# Altium schematic sheet MainBoard.SchDoc
size A4; SheetNumber: 1; SheetTotal: 6
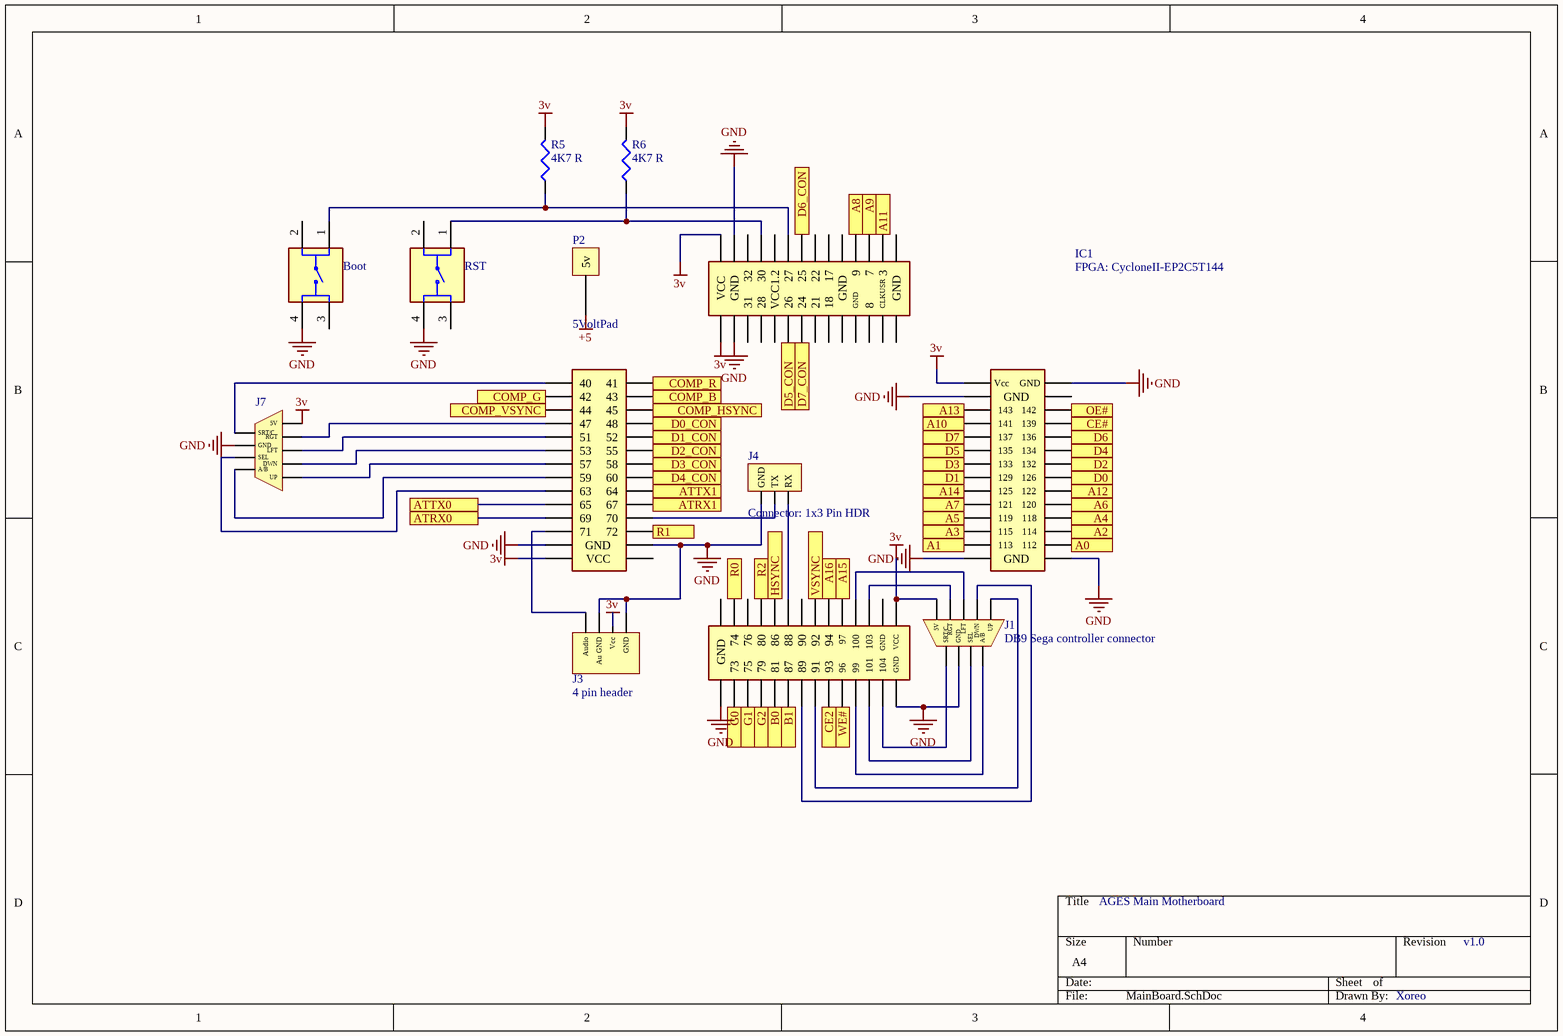
[diagram p0: MainBoard.SchDoc]

## Parts
Boot  Button  [Button]  (value not drawn)
IC1  FPGA: CycloneII-EP2C5T144  [Cyclone II]
J1  DB9 Sega controller connector  [DB9 Connector]
J3  4 pin header  [4 HDR]
J4  Connector: 1x3 Pin HDR  [3 HDR]
J7  DB9 Sega controller connector  [DB9 Connector]  (value not drawn)
P2  5VoltPad  [5VoltPad]
R5  4K7 R  [Resistor 0603]
R6  4K7 R  [Resistor 0603]
RST  Button  [Button]  (value not drawn)

## Ports
A0, A1, A2, A3, A4, A5, A6, A7, A8, A9, A10, A11, A12, A13, A14, A15, A16, ATRX0, ATRX1, ATTX0, ATTX1, B0, B1, CE2, CE#, COMP_B, COMP_G, COMP_HSYNC, COMP_R, COMP_VSYNC, D0, D0_CON, D1, D1_CON, D2, D2_CON, D3, D3_CON, D4, D4_CON, D5, D5_CON, D6, D6_CON, D7, D7_CON, G0, G1, G2, HSYNC, OE#, R0, R1, R2, VSYNC, WE#

## Nets
3v: IC1.27(VCC) IC1.28(VCC) IC1.55 IC1.57(VCC) IC1.86(Vcc) J1.5(5V) J3.2(Vcc) J7.5(5V) R5.2 R6.2
+5: P2.1(5v)
GND: Boot.4 IC1.25(GND) IC1.26(GND) IC1.53 IC1.54(GND) IC1.58(GND) IC1.84(GND) IC1.85(GND) IC1.88 IC1.111(GND) IC1.112 J1.8(GND) J3.1(GND) J3.3(Au_GND) J4.1(GND) J7.8(GND) RST.4
A0: IC1.109(112) ; port A0
A1: IC1.110(113) ; port A1
A2: IC1.107(114) ; port A2
A3: IC1.108(115) ; port A3
A4: IC1.105(118) ; port A4
A5: IC1.106(119) ; port A5
A6: IC1.103(120) ; port A6
A7: IC1.104(121) ; port A7
A8: IC1.7(9) ; port A8
A9: IC1.5(7) ; port A9
A10: IC1.92(141) ; port A10
A11: IC1.3 ; port A11
A12: IC1.101(122) ; port A12
A13: IC1.90(143) ; port A13
A14: IC1.102(125) ; port A14
A15: IC1.65(97) ; port A15
A16: IC1.67(94) ; port A16
ATRX0: IC1.49(69) ; port ATRX0
ATRX1: IC1.48(67) ; port ATRX1
ATTX0: IC1.47(65) ; port ATTX0
ATTX1: IC1.46(64) ; port ATTX1
B0: IC1.76(81) ; port B0
B1: IC1.74(87) ; port B1
CE2: IC1.68(93) ; port CE2
CE#: IC1.91(139) ; port CE#
COMP_B: IC1.32(43) ; port COMP_B
COMP_G: IC1.31(42) ; port COMP_G
COMP_HSYNC: IC1.34(45) ; port COMP_HSYNC
COMP_R: IC1.30(41) ; port COMP_R
COMP_VSYNC: IC1.33(44) ; port COMP_VSYNC
D0: IC1.99(126) ; port D0
D0_CON: IC1.36(48) ; port D0_CON
D1: IC1.100(129) ; port D1
D1_CON: IC1.38(52) ; port D1_CON
D2: IC1.97(132) ; port D2
D2_CON: IC1.40(55) ; port D2_CON
D3: IC1.98(133) ; port D3
D3_CON: IC1.42(58) ; port D3_CON
D4: IC1.95(134) ; port D4
D4_CON: IC1.44(60) ; port D4_CON
D5: IC1.96(135) ; port D5
D5_CON: IC1.18(26) ; port D5_CON
D6: IC1.93(136) ; port D6
D6_CON: IC1.15(25) ; port D6_CON
D7: IC1.94(137) ; port D7
D7_CON: IC1.16(24) ; port D7_CON
G0: IC1.82(73) ; port G0
G1: IC1.80(75) ; port G1
G2: IC1.78(79) ; port G2
HSYNC: IC1.75(86) ; port HSYNC
OE#: IC1.89(142) ; port OE#
R0: IC1.81(74) ; port R0
R1: IC1.52(72) ; port R1
R2: IC1.77(80) ; port R2
VSYNC: IC1.69(92) ; port VSYNC
WE#: IC1.66(96) ; port WE#
NetBoot_1: Boot.1 IC1.17(27) R5.1
NetIC1_21: IC1.21(30) R6.1 RST.1
NetIC1_29: IC1.29(40) J7.9(SRT/C)
NetIC1_35: IC1.35(47) J7.4(RGT)
NetIC1_37: IC1.37(51) J7.3(LFT)
NetIC1_39: IC1.39(53) J7.2(DWN)
NetIC1_41: IC1.41(57) J7.1(UP)
NetIC1_43: IC1.43(59) J7.6(A/B)
NetIC1_45: IC1.45(63) J7.7(SEL)
NetIC1_50: IC1.50(70) J4.2(TX)
NetIC1_51: IC1.51(71) J3.4(Audio)
NetIC1_60: IC1.60(104) J1.9(SRT/C)
NetIC1_61: IC1.61(103) J1.4(RGT)
NetIC1_62: IC1.62(101) J1.7(SEL)
NetIC1_63: IC1.63(100) J1.3(LFT)
NetIC1_64: IC1.64(99) J1.6(A/B)
NetIC1_70: IC1.70(91) J1.1(UP)
NetIC1_72: IC1.72(89) J1.2(DWN)
NetIC1_73: IC1.73(88) J4.3(RX)

Not connected (* = marked no-connect by the designer): Boot 2 3; IC1 1(GND) 2(GND) 4(CLKUSR) 6(8) 8(GND) 9(GND) 10(GND) 11(17) 12(18) 13(22) 14(21) 19(VCC1.2) 20(VCC1.2) 22(28) 23(32) 24(31) 56(VCC) 59(GND) 71(90) 79(76) 83(VCC) 87(GND); RST 2 3

## Notes on the sheet
- AGES Main Motherboard
- v1.0
- Xoreo

## Library data of the parts
Boot RST = Button: 50 mA SPST Round Actuator 160 Gram Force Tactile Pushbutton Switch; MP: 1825910-2; MF: TE Connectivity; Check_prices: https://www.snapeda.com/parts/1825910-2/TE+Connectivity+ALCOSWITCH+Switches/view-part/?ref=eda; Value: *; Availability: In Stock; Price: None; Package: None; SnapEDA_Link: https://www.snapeda.com/parts/1825910-2/TE+Connectivity+ALCOSWITCH+Switches/view-part/?ref=snap; Purchase-URL: https://pricing.snapeda.com/search/part/1825910-2/?ref=eda; EU_RoHS_Compliance: Compliant
J1 J7 = Connector: DB9: 9 Way Right Angle Through Hole PCB D-sub Connector Socket; 2.77mm; 2.84mm Pitch; Manufacturer: Wurth Electronics; Manufacturer Part Number: 618009231321; Gender: Female; Current Rating: 3A; Number of Contacts: 9; Voltage Rating: 125V; Supplier 1: Farnell; RoHS: Yes; Category: D-Sub Connectors; Stock 1: 287; Pricing 1: 1=3,44000, 10=2,90000, 100=2,52000, 250=2,17000, 500=1,93000, 1000=1,89000 (EUR); Mount: Through Hole; Contact Material: Copper Alloy; Contact Plating: Gold; Housing Material: Steel; Min Operating Temperature: -40°C; Max Operating Temperature: 85°C; Series: 618; Number of Rows: 2; Termination: SMD/SMT; Orientation: Right Angle; Length: 30.8mm; Width: 12.5mm; Depth: 20.75mm; Pitch: 2.84mm; RoHS Compliant: Yes; Lead Free: Lead Free; ComponentLink1URL: https://datasheet.ciiva.com/25605/0900766b81191772-25605489.pdf?src-supplier=Rs; ComponentLink1Description: https://datasheet.ciiva.com/25605/0900766b81191772-25605489.pdf?src-supplier=Rs; ComponentLink2URL: https://datasheet.ciiva.com/12669/6180xx231321-12669192.pdf?src-supplier=Mouser; ComponentLink2Description: https://datasheet.ciiva.com/12669/6180xx231321-12669192.pdf?src-supplier=Mouser; Supplier Part Number 1: 1841197
J3 = Connector: 4 pin header: Male 4 pin header
R5 R6 = Resistor: 4K7: Surface Mount Metal Film Resistor, Pcf Series, 4.7 Kohm, 63 Mw, - 0.1%, 75 V Rohs Compliant: Yes; Manufacturer: TT Welwyn; Manufacturer Part Number: PCF0603P-R-4K7-BT1; Power Rating: 63mW; Voltage Rating: 75V; Resistance: 4.7kR; Temperature Coefficient: 25ppm/°C; Case/Category: 0603; Supplier 1: Newark; RoHS: Yes; Category: Chip SMD Resistors; Stock 1: 1027; Pricing 1: 10=0,17900 (USD); Case Code (Imperial): 0603; Case Code (Metric): 1608; Tolerance: 0.1%; Packaging: Cut Tape; Resistor Type: Thin Film; Voltage Rating (DC): 75V; REACH SVHC: No SVHC; ComponentLink1URL: https://datasheet.ciiva.com/7860/3754-7860191.pdf?src-supplier=Element14; ComponentLink1Description: https://datasheet.ciiva.com/7860/3754-7860191.pdf?src-supplier=Element14; ComponentLink2URL: https://datasheet.ciiva.com/6093/3754-6093381.pdf?src-supplier=Farnell; ComponentLink2Description: https://datasheet.ciiva.com/6093/3754-6093381.pdf?src-supplier=Farnell; Supplier Part Number 1: 61M8292